# EAGLE schematic Night_Clock_2 (EAGLE 6.5.0)
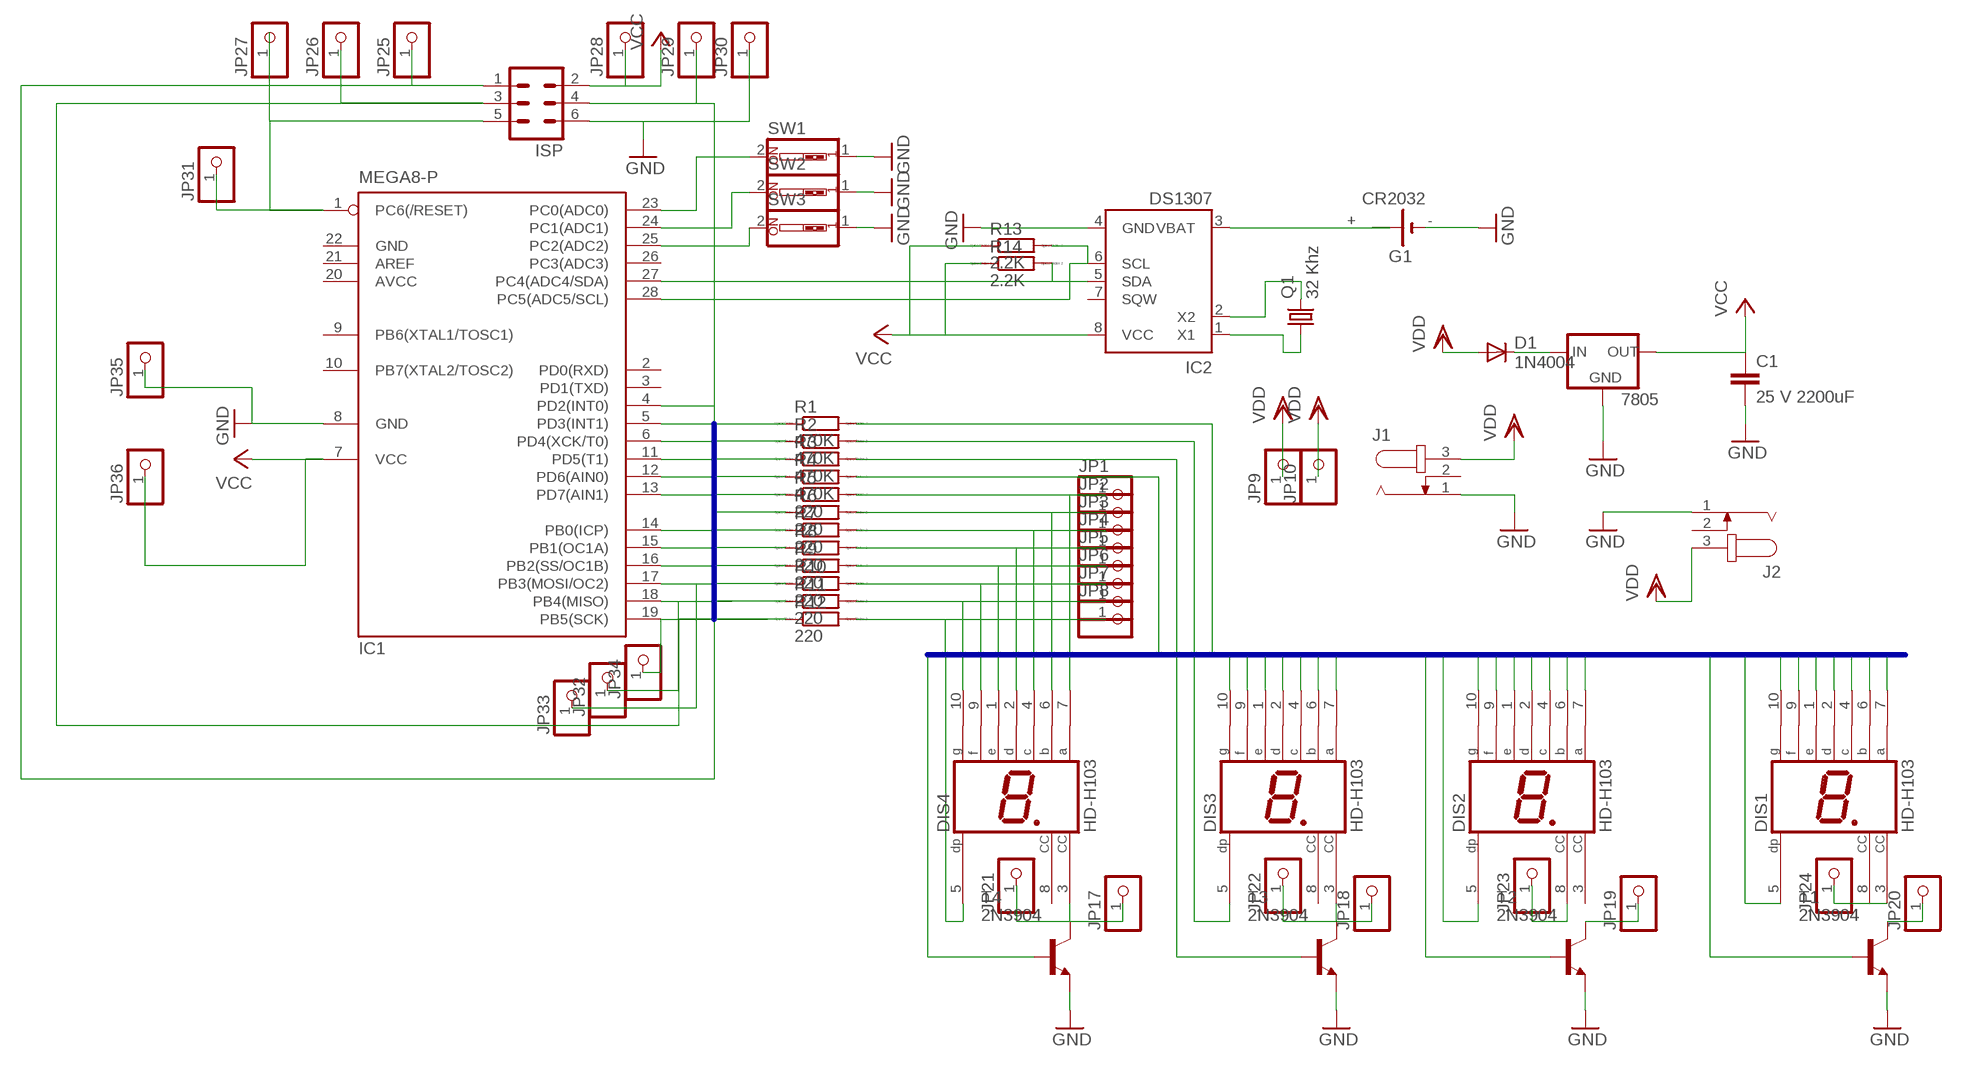
[diagram p0: schematic, sheet 1]

## Parts
7805  78XXS  [78XXS]
C1  25 V 2200uF  C2.5/5  [C2.5-5]
D1  1N4004  [DO41-10]
DIS1  HD-H103  [HDSP-M]
DIS2  HD-H103  [HDSP-M]
DIS3  HD-H103  [HDSP-M]
DIS4  HD-H103  [HDSP-M]
G1  CR2032  B2430UNI  [B2430UNI]
IC1  MEGA8-P  [DIL28-3]
IC2  DS1307  [DIP-8]
ISP  MA03-2  [MA03-2]
J1  JACK-PLUG1  [SPC4078]
J2  JACK-PLUG1  [SPC4078]
JP1  PINHD-1X1  [1X01]
JP2  PINHD-1X1  [1X01]
JP3  PINHD-1X1  [1X01]
JP4  PINHD-1X1  [1X01]
JP5  PINHD-1X1  [1X01]
JP6  PINHD-1X1  [1X01]
JP7  PINHD-1X1  [1X01]
JP8  PINHD-1X1  [1X01]
JP9  PINHD-1X1  [1X01]
JP10  PINHD-1X1  [1X01]
JP17  PINHD-1X1  [1X01]
JP18  PINHD-1X1  [1X01]
JP19  PINHD-1X1  [1X01]
JP20  PINHD-1X1  [1X01]
JP21  PINHD-1X1  [1X01]
JP22  PINHD-1X1  [1X01]
JP23  PINHD-1X1  [1X01]
JP24  PINHD-1X1  [1X01]
JP25  PINHD-1X1  [1X01]
JP26  PINHD-1X1  [1X01]
JP27  PINHD-1X1  [1X01]
JP28  PINHD-1X1  [1X01]
JP29  PINHD-1X1  [1X01]
JP30  PINHD-1X1  [1X01]
JP31  PINHD-1X1  [1X01]
JP32  PINHD-1X1  [1X01]
JP33  PINHD-1X1  [1X01]
JP34  PINHD-1X1  [1X01]
JP35  PINHD-1X1  [1X01]
JP36  PINHD-1X1  [1X01]
Q1  32 Khz  CRYSTALTC26V  [TC26V]
R1  470K  R0207/10  [0207/10]
R2  470K  R0207/10  [0207/10]
R3  470K  R0207/10  [0207/10]
R4  470K  R0207/10  [0207/10]
R5  220  R0207/10  [0207/10]
R6  220  R0207/10  [0207/10]
R7  220  R0207/10  [0207/10]
R8  220  R0207/10  [0207/10]
R9  220  R0207/10  [0207/10]
R10  220  R0207/10  [0207/10]
R11  220  R0207/10  [0207/10]
R12  220  R0207/10  [0207/10]
R13  2.2K  R0207/10  [0207/10]
R14  2.2K  R0207/10  [0207/10]
SW1  SW_DIP-1  [EDG-01]
SW2  SW_DIP-1  [EDG-01]
SW3  SW_DIP-1  [EDG-01]
T1  2N3904  [TO92]
T2  2N3904  [TO92]
T3  2N3904  [TO92]
T4  2N3904  [TO92]

## Nets
7SEG1: DIS1.7(A) DIS2.4(C) DIS3.7(A) DIS4.9(F) JP6.1 R10.2
7SEG2: DIS1.6(B) DIS2.5(DP) DIS3.6(B) DIS4.10(G) JP7.1 R11.2
7SEG3: DIS1.4(C) DIS2.7(A) DIS3.4(C) DIS4.2(D) JP3.1 R7.2
7SEG4: DIS1.2(D) DIS2.9(F) DIS3.2(D) DIS4.4(C) JP2.1 R6.2
7SEG5: DIS1.1(E) DIS2.10(G) DIS3.1(E) DIS4.5(DP) JP1.1 R5.2
7SEG6: DIS1.9(F) DIS2.2(D) DIS3.9(F) DIS4.7(A) JP5.1 R9.2
7SEG7: DIS1.10(G) DIS2.1(E) DIS3.10(G) DIS4.6(B) JP4.1 R8.2
7SEG8: DIS1.5(DP) DIS2.6(B) DIS3.5(DP) DIS4.1(E) JP8.1 R12.2
7SEG9: R4.2 T4.2(B)
7SEG10: R3.2 T3.2(B)
7SEG11: R2.2 T2.2(B)
7SEG12: R1.2 T1.2(B)
GND: 7805.GND C1.2 G1.-@1(-) IC1.8(GND) IC2.4(GND) ISP.6 J1.1 J2.1 JP30.1 JP35.1 SW1.1 SW2.1 SW3.1 T1.3(E) T2.3(E) T3.3(E) T4.3(E)
MEG2LED1: IC1.4(PD2(INT0)) R1.1
MEG2LED2: IC1.5(PD3(INT1)) R2.1
MEG2LED3: IC1.6(PD4(XCK/T0)) R3.1
MEG2LED4: IC1.11(PD5(T1)) R4.1
MEG2LED5: IC1.12(PD6(AIN0)) R5.1
MEG2LED6: IC1.13(PD7(AIN1)) R6.1
MEG2LED7: IC1.14(PB0(ICP)) R7.1
MEG2LED8: IC1.15(PB1(OC1A)) R8.1
MEG2LED9: IC1.16(PB2(SS/OC1B)) R9.1
MEG2LED10: IC1.17(PB3(MOSI/OC2)) ISP.4 JP29.1 JP33.1 R10.1
MEG2LED11: IC1.18(PB4(MISO)) ISP.1 JP25.1 JP32.1 R11.1
MEG2LED12: IC1.19(PB5(SCK)) ISP.3 JP26.1 JP34.1 R12.1
N$5: IC1.1(PC6(/RESET)) ISP.5 JP27.1 JP31.1
N$6: IC1.27(PC4(ADC4/SDA)) IC2.5(SDA) R14.2
N$7: IC1.28(PC5(ADC5/SCL)) IC2.6(SCL) R13.2
N$8: JP17.1 T4.1(C)
N$9: JP18.1 T3.1(C)
N$10: IC1.23(PC0(ADC0)) SW1.2
N$11: IC1.24(PC1(ADC1)) SW2.2
N$12: IC1.25(PC2(ADC2)) SW3.2
N$13: G1.+@4(+) IC2.3(VBAT)
N$14: IC2.2(X2) Q1.2
N$15: IC2.1(X1) Q1.1
N$16: 7805.IN D1.C
N$17: JP19.1 T2.1(C)
N$18: JP20.1 T1.1(C)
N$19: DIS1.3(CC) JP24.1
N$20: DIS2.8(CC) JP23.1
N$21: DIS3.3(CC) JP22.1
N$22: DIS4.3(CC) JP21.1
VCC: 7805.OUT C1.1 IC1.7(VCC) IC2.8(VCC) ISP.2 JP28.1 JP36.1 R13.1 R14.1
VDD: D1.A J1.3 J2.3 JP9.1 JP10.1
Unconnected: DIS1.8(CC) DIS2.3(CC) DIS3.8(CC) DIS4.8(CC) G1.+ G1.+@1(+) G1.+@2(+) G1.+@3(+) G1.- IC1.2(PD0(RXD)) IC1.3(PD1(TXD)) IC1.9(PB6(XTAL1/TOSC1)) IC1.10(PB7(XTAL2/TOSC2)) IC1.21(AREF) IC1.26(PC3(ADC3)) IC2.7(SQW) J1.2 J2.2

## Buses
7SEG[1..12]
MEG2LED[1..12]

## Power pins joined to a net without a drawn wire
AVCC: IC1.20(AVCC)
GND: IC1.22(GND)

## Library data of the parts
7805 = v-reg:78XXS: VOLTAGE REGULATOR
C1 = capacitor-wima:C: CAPACITOR naming: grid - package width
D1 = diode:1N4004: DIODE general purpose rectifier, 1 A
DIS1-DIS4 = display-hp:HD-H103: LED DISPLAY 1-character 7 segment, decimal point right; OC_FARNELL: unknown; OC_NEWARK: unknown
G1 = battery:B2430UNI: LI BATTERY
IC1 = atmel:MEGA8-P: MICROCONTROLLER 8 Kbytes FLASH, 1 kbytes SRAM, 512 bytes EEPROM, USART, 4-channel 10 bit ADC, 2-channel 8 bit ADC Pin compatible with Atmega48, ATMega88, ATMega168 Source: avr.lbr; OC_FARNELL: unknown; OC_NEWARK: unknown
IC2 = DS1307:DS1307: DS1307 - 64×8, Serial, I2C Real Time Clock
ISP = con-lstb:MA03-2: PIN HEADER; OC_FARNELL: unknown; OC_NEWARK: unknown
J1 J2 = con-jack:JACK-PLUG: DC POWER JACK Power Jack, DC, Right Angle, Through Hole, Rated 5A at 16VDC, PC Terminals Distributor: Farnell (www.Farnell.de) Drawing: 84N1161.pdf / 84N1162.pdf Manufacturer: SPC Technology (www.spctechnology.com) Type: SPC4077 / SPC 4078; OC_FARNELL: unknown; OC_NEWARK: unknown
JP1-JP10 JP17-JP36 = pinhead:PINHD-1X1: PIN HEADER
Q1 = crystal:CRYSTAL: CRYSTAL; OC_FARNELL: unknown; OC_NEWARK: unknown
R1-R14 = eagle-ltspice:R: RESISTOR, European symbol; SPICEMODEL: NONE; SPICEPREFIX: R
SW1-SW3 = special:SW_DIP-1: DIP SWITCH
T1-T4 = transistor:2N3904: NPN TRANSISTOR

## Net classes
0 default: width 0.381 mm